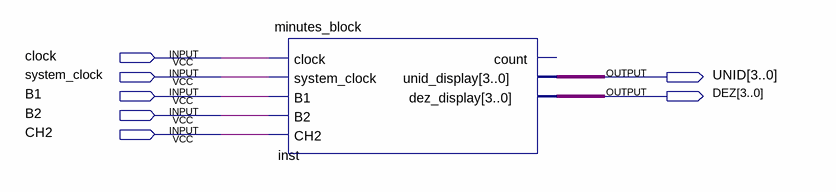
[diagram p0: schematic sheet]
// Quartus schematic minutes_block_test.bdf as structural Verilog: 1 symbols, 7 pins
module minutes_block_test (
  input  clock,
  input  system_clock,
  input  B1,
  input  B2,
  input  CH2,
  output [3:0] UNID,
  output [3:0] DEZ
);

  minutes_block inst (
    .clock(clock), .system_clock(system_clock), .B1(B1), .B2(B2), .CH2(CH2), .unid_display(UNID),
    .dez_display(DEZ));  // open: count
endmodule
